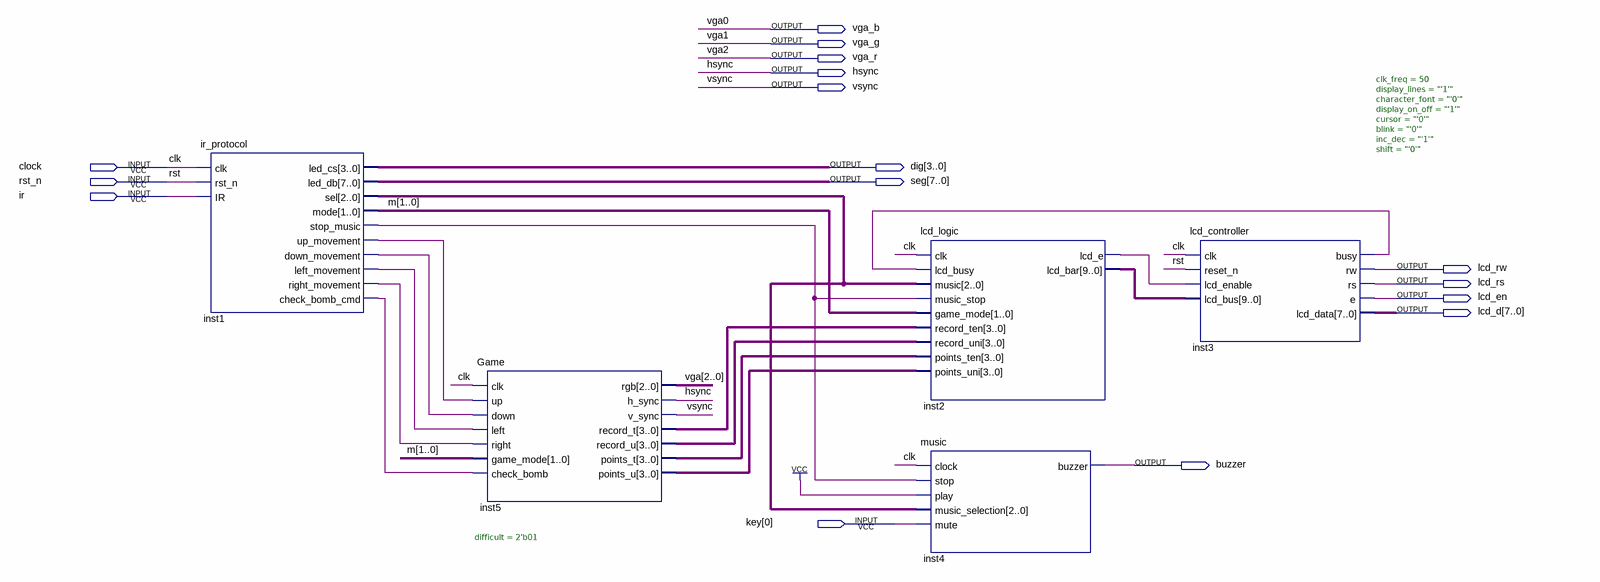
[diagram p0: schematic sheet]
// Quartus schematic subtop_test.bdf as structural Verilog: 5 symbols, 16 pins
module subtop_test (
  input  clock,
  input  rst_n,
  input  ir,
  input  [0:0] key,
  output vga_b,
  output vga_g,
  output vga_r,
  output hsync,
  output vsync,
  output [3:0] dig,
  output [7:0] seg,
  output lcd_rw,
  output lcd_rs,
  output lcd_en,
  output [7:0] lcd_d,
  output buzzer
);

  wire inst1_check_bomb_cmd, inst1_down_movement, inst1_left_movement, inst1_right_movement,
       inst1_stop_music, inst1_up_movement, inst2_lcd_e, inst3_busy;
  wire [1:0] m;
  wire [2:0] inst1_sel;
  wire [3:0] inst5_points_t, inst5_points_u, inst5_record_t, inst5_record_u;
  wire [9:0] inst2_lcd_bar;

  ir_protocol inst1 (
    .clk(clock), .rst_n(rst_n), .IR(ir), .led_cs(dig), .led_db(seg), .sel(inst1_sel), .mode(m),
    .stop_music(inst1_stop_music), .up_movement(inst1_up_movement), .down_movement(inst1_down_movement),
    .left_movement(inst1_left_movement), .right_movement(inst1_right_movement),
    .check_bomb_cmd(inst1_check_bomb_cmd));
  Game #(.difficult(2'b01)) inst5 (
    .clk(clock), .up(inst1_up_movement), .down(inst1_down_movement), .left(inst1_left_movement),
    .right(inst1_right_movement), .game_mode(m), .check_bomb(inst1_check_bomb_cmd),
    .rgb({vga_r, vga_g, vga_b}), .h_sync(hsync), .v_sync(vsync), .record_t(inst5_record_t),
    .record_u(inst5_record_u), .points_t(inst5_points_t), .points_u(inst5_points_u));
  lcd_logic inst2 (
    .clk(clock), .lcd_busy(inst3_busy), .music(inst1_sel), .music_stop(inst1_stop_music), .game_mode(m),
    .record_ten(inst5_record_t), .record_uni(inst5_record_u), .points_ten(inst5_points_t),
    .points_uni(inst5_points_u), .lcd_e(inst2_lcd_e), .lcd_bar(inst2_lcd_bar));
  music inst4 (
    .clock(clock), .stop(inst1_stop_music), .play(1'b1), .music_selection(inst1_sel), .mute(key[0]),
    .buzzer(buzzer));
  lcd_controller #(.clk_freq(50), .display_lines("'1'"), .character_font("'0'"), .display_on_off("'1'"), .cursor("'0'"), .blink("'0'"), .inc_dec("'1'"), .shift("'0'")) inst3 (
    .clk(clock), .reset_n(rst_n), .lcd_enable(inst2_lcd_e), .lcd_bus(inst2_lcd_bar), .busy(inst3_busy),
    .rw(lcd_rw), .rs(lcd_rs), .e(lcd_en), .lcd_data(lcd_d));

  // Other names for the same wires on the sheet: clk = clock; rst = rst_n; vga[2:0] = {vga_r, vga_g, vga_b};
  //   vga0 = vga_b; vga1 = vga_g; vga2 = vga_r
endmodule
